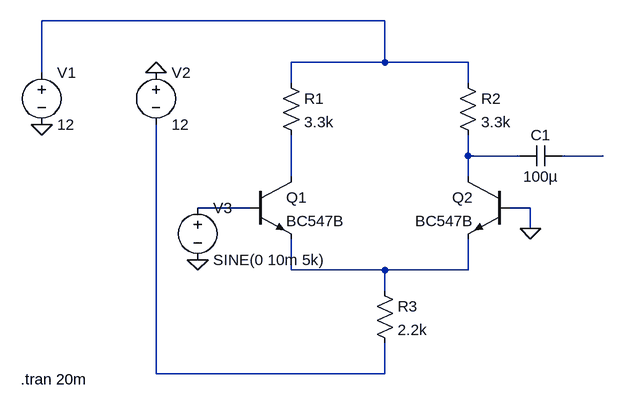
[diagram p0: schematic differential_amplifier.asc]
differential_amplifier.asc, the LTspice schematic file:
Version 4
SHEET 1 1484 680
WIRE 176 -160 -352 -160
WIRE 176 -96 176 -160
WIRE 176 -96 32 -96
WIRE 304 -96 176 -96
WIRE -352 -80 -352 -160
WIRE 32 -64 32 -96
WIRE 304 -64 304 -96
WIRE 304 48 304 16
WIRE 384 48 304 48
WIRE 512 48 448 48
WIRE 32 80 32 16
WIRE 304 80 304 48
WIRE -32 128 -112 128
WIRE 400 128 368 128
WIRE 400 160 400 128
WIRE 32 224 32 176
WIRE 176 224 32 224
WIRE 304 224 304 176
WIRE 304 224 176 224
WIRE 176 256 176 224
WIRE -176 384 -176 0
WIRE 176 384 176 336
WIRE 176 384 -176 384
FLAG -352 0 0
FLAG -176 -80 0
FLAG 400 160 0
FLAG -112 208 0
SYMBOL npn -32 80 R0
SYMATTR InstName Q1
SYMATTR Value BC547B
SYMBOL npn 368 80 M0
SYMATTR InstName Q2
SYMATTR Value BC547B
SYMBOL res 16 -80 R0
SYMATTR InstName R1
SYMATTR Value 3.3k
SYMBOL res 288 -80 R0
SYMATTR InstName R2
SYMATTR Value 3.3k
SYMBOL res 160 240 R0
SYMATTR InstName R3
SYMATTR Value 2.2k
SYMBOL voltage -352 -96 R0
WINDOW 123 0 0 Left 0
WINDOW 39 0 0 Left 0
SYMATTR InstName V1
SYMATTR Value 12
SYMBOL voltage -176 -96 R0
WINDOW 123 0 0 Left 0
WINDOW 39 0 0 Left 0
SYMATTR InstName V2
SYMATTR Value 12
SYMBOL voltage -112 112 R0
WINDOW 123 0 0 Left 0
WINDOW 39 0 0 Left 0
SYMATTR InstName V3
SYMATTR Value SINE(0 10m 5k)
SYMBOL cap 448 32 R90
WINDOW 0 0 32 VBottom 2
WINDOW 3 32 32 VTop 2
SYMATTR InstName C1
SYMATTR Value 100µ
TEXT -384 392 Left 2 !.tran 20m

The netlist it stands for:
* differential_amplifier.asc
Q1 N004 N005 N006 0 BC547B
Q2 N002 0 N006 0 BC547B
R1 N001 N004 3.3k
R2 N001 N002 3.3k
R3 N006 N007 2.2k
V1 N001 0 12
V2 0 N007 12
V3 N005 0 SINE(0 10m 5k)
C1 N003 N002 100µ
.model NPN NPN
.model PNP PNP
.lib standard.bjt
.tran 20m
.backanno
.end